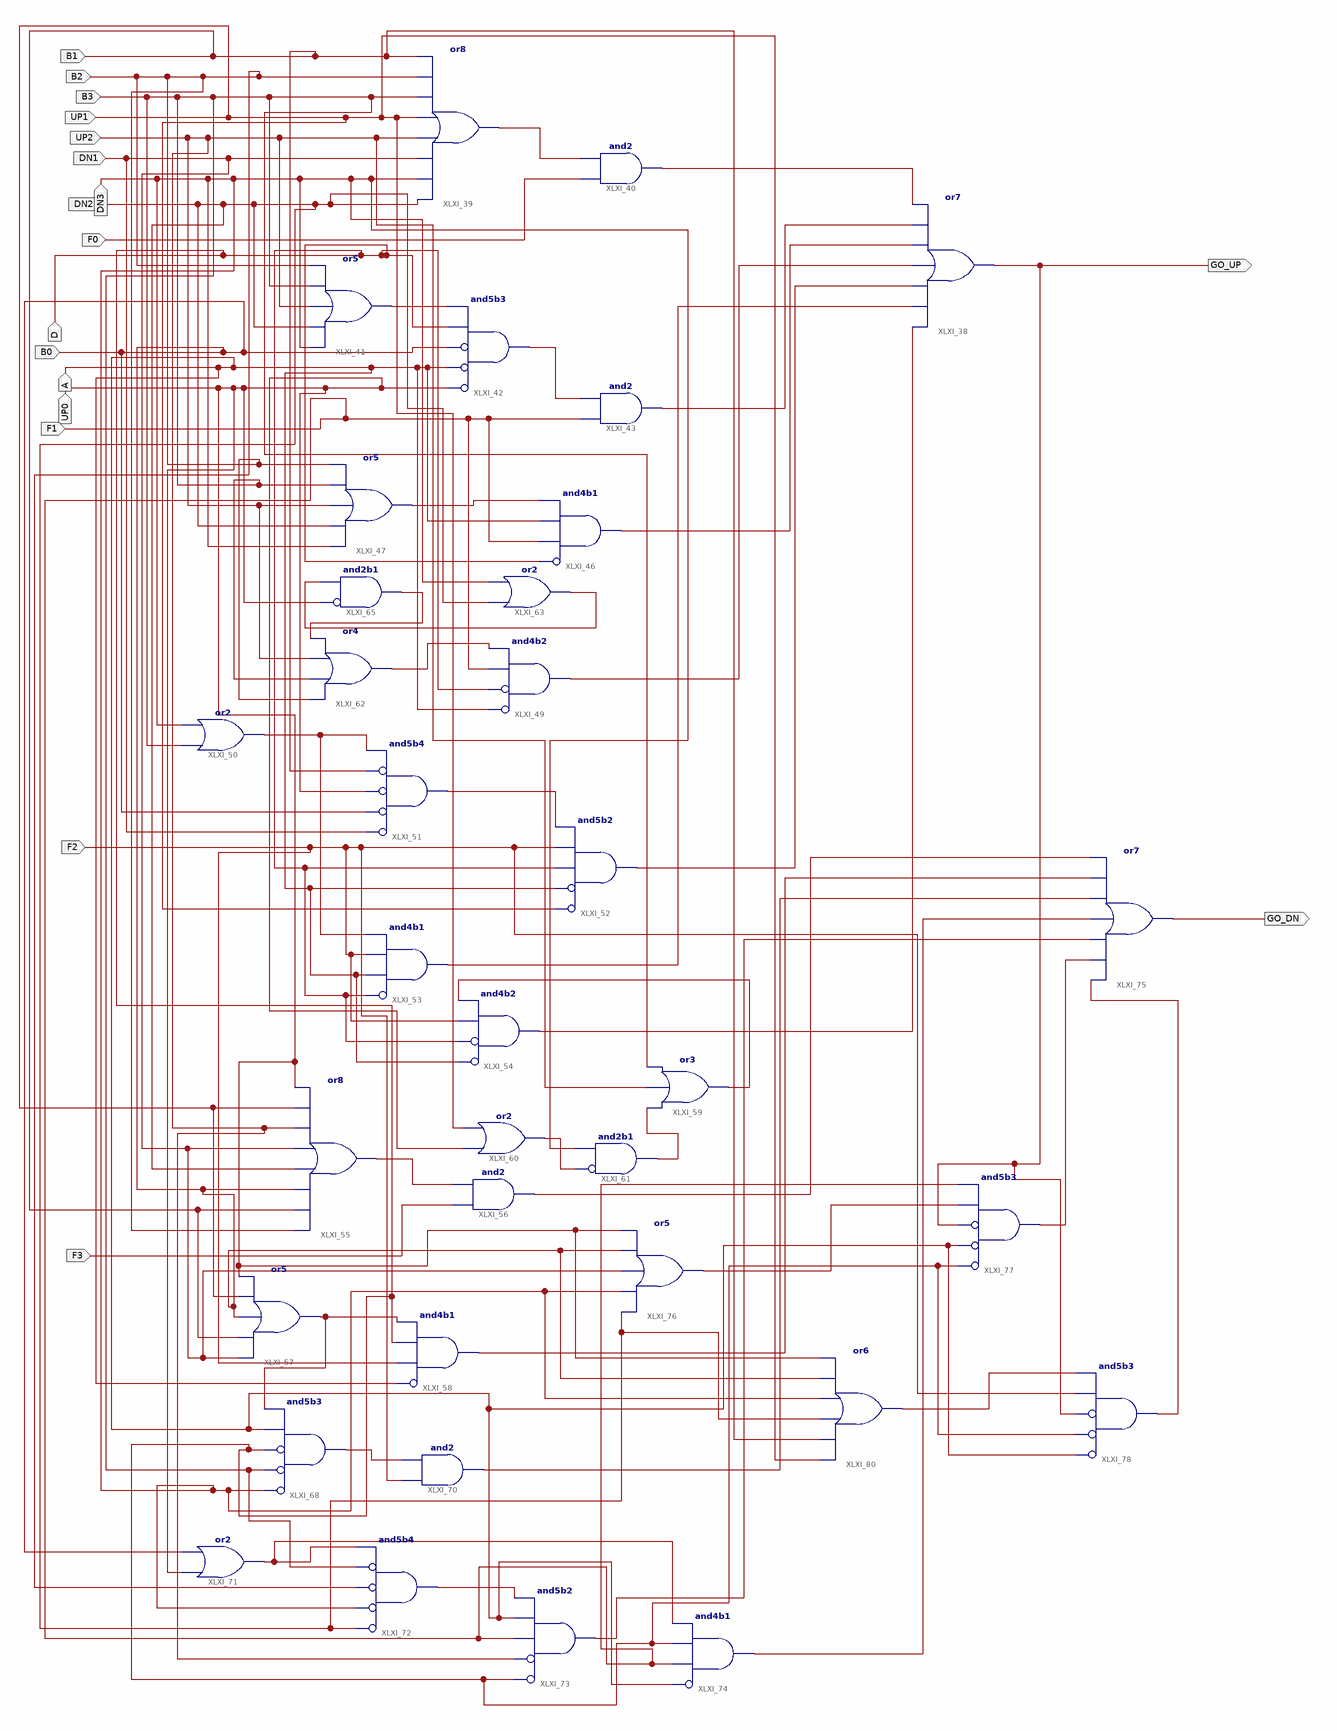
[diagram p0: schematic sheet 1]
// Xilinx ISE schematic Lab1.sch (spartan6) as structural Verilog: 35 symbols, 18 ports
module Lab1 (
  input  B1,
  input  B2,
  input  B3,
  input  UP1,
  input  UP2,
  input  DN1,
  input  DN3,
  input  DN2,
  input  F0,
  input  D,
  input  B0,
  input  A,
  input  UP0,
  input  F1,
  input  F2,
  input  F3,
  output GO_UP,
  output GO_DN
);

  wire XLXN_77, XLXN_79, XLXN_85, XLXN_90, XLXN_92, XLXN_98, XLXN_101, XLXN_109, XLXN_115, XLXN_117,
       XLXN_118, XLXN_122, XLXN_125, XLXN_128, XLXN_137, XLXN_139, XLXN_140, XLXN_143, XLXN_145, XLXN_146,
       XLXN_148, XLXN_150, XLXN_151, XLXN_154, XLXN_155, XLXN_156, XLXN_157, XLXN_158, XLXN_159, XLXN_160,
       XLXN_169, XLXN_172, XLXN_173;

  or XLXI_38 (GO_UP, XLXN_125, XLXN_122, XLXN_117, XLXN_109, XLXN_101, XLXN_92, XLXN_79);
  or XLXI_39 (XLXN_77, DN2, DN3, DN1, UP2, UP1, B3, B2, B1);
  and XLXI_40 (XLXN_79, F0, XLXN_77);
  or XLXI_41 (XLXN_85, DN3, DN2, UP2, B3, B2);
  and XLXI_42 (XLXN_90, ~UP0, ~A, ~B0, D, XLXN_85);  // and5b3
  and XLXI_43 (XLXN_92, F1, XLXN_90);
  and XLXI_46 (XLXN_101, ~D, F1, A, XLXN_98);  // and4b1
  or XLXI_47 (XLXN_98, DN3, DN2, UP2, B3, B2);
  and XLXI_49 (XLXN_109, ~A, ~D, F1, XLXN_145);  // and4b2
  or XLXI_50 (XLXN_118, B3, DN3);
  and XLXI_51 (XLXN_115, ~DN1, ~B0, ~UP0, ~B1, XLXN_118);  // and5b4
  and XLXI_52 (XLXN_117, ~UP1, ~A, D, F2, XLXN_115);  // and5b2
  and XLXI_53 (XLXN_122, ~D, A, F2, XLXN_118);  // and4b1
  and XLXI_54 (XLXN_125, ~A, ~D, F2, XLXN_140);  // and4b2
  or XLXI_55 (XLXN_128, B2, B1, B0, DN2, DN1, UP2, UP1, UP0);
  and XLXI_56 (XLXN_155, F3, XLXN_128);
  or XLXI_57 (XLXN_148, DN1, B1, B0, UP1, UP0);
  and XLXI_58 (XLXN_156, ~A, F2, D, XLXN_148);  // and4b1
  or XLXI_59 (XLXN_140, XLXN_139, UP2, B3);
  or XLXI_60 (XLXN_137, UP0, UP1);
  and XLXI_61 (XLXN_139, ~XLXN_137, DN3);  // and2b1
  or XLXI_62 (XLXN_145, B2, B3, UP2, XLXN_146);
  or XLXI_63 (XLXN_143, DN2, DN3);
  and XLXI_65 (XLXN_146, ~UP0, XLXN_143);  // and2b1
  and XLXI_68 (XLXN_150, ~DN3, ~B3, ~D, A, XLXN_148);  // and5b3
  and XLXI_70 (XLXN_157, F2, XLXN_150);
  or XLXI_71 (XLXN_151, UP0, B0);
  and XLXI_72 (XLXN_154, ~DN2, ~DN3, ~B2, ~B3, XLXN_151);  // and5b4
  and XLXI_73 (XLXN_159, ~D, ~UP2, F1, A, XLXN_154);  // and5b2
  and XLXI_74 (XLXN_158, ~A, F1, D, XLXN_151);  // and4b1
  or XLXI_75 (GO_DN, XLXN_173, XLXN_172, XLXN_159, XLXN_158, XLXN_157, XLXN_156, XLXN_155);
  or XLXI_76 (XLXN_160, DN2, DN3, DN1, B0, UP0);
  and XLXI_77 (XLXN_172, ~D, ~A, ~GO_UP, XLXN_160, F1);  // and5b3
  and XLXI_78 (XLXN_173, ~A, ~D, ~GO_UP, F2, XLXN_169);  // and5b3
  or XLXI_80 (XLXN_169, UP1, B1, DN2, DN3, B0, UP0);
endmodule
